# Altium schematic sheet Sheet_1_2023-11-30.schdoc
size 319 x 219 mm
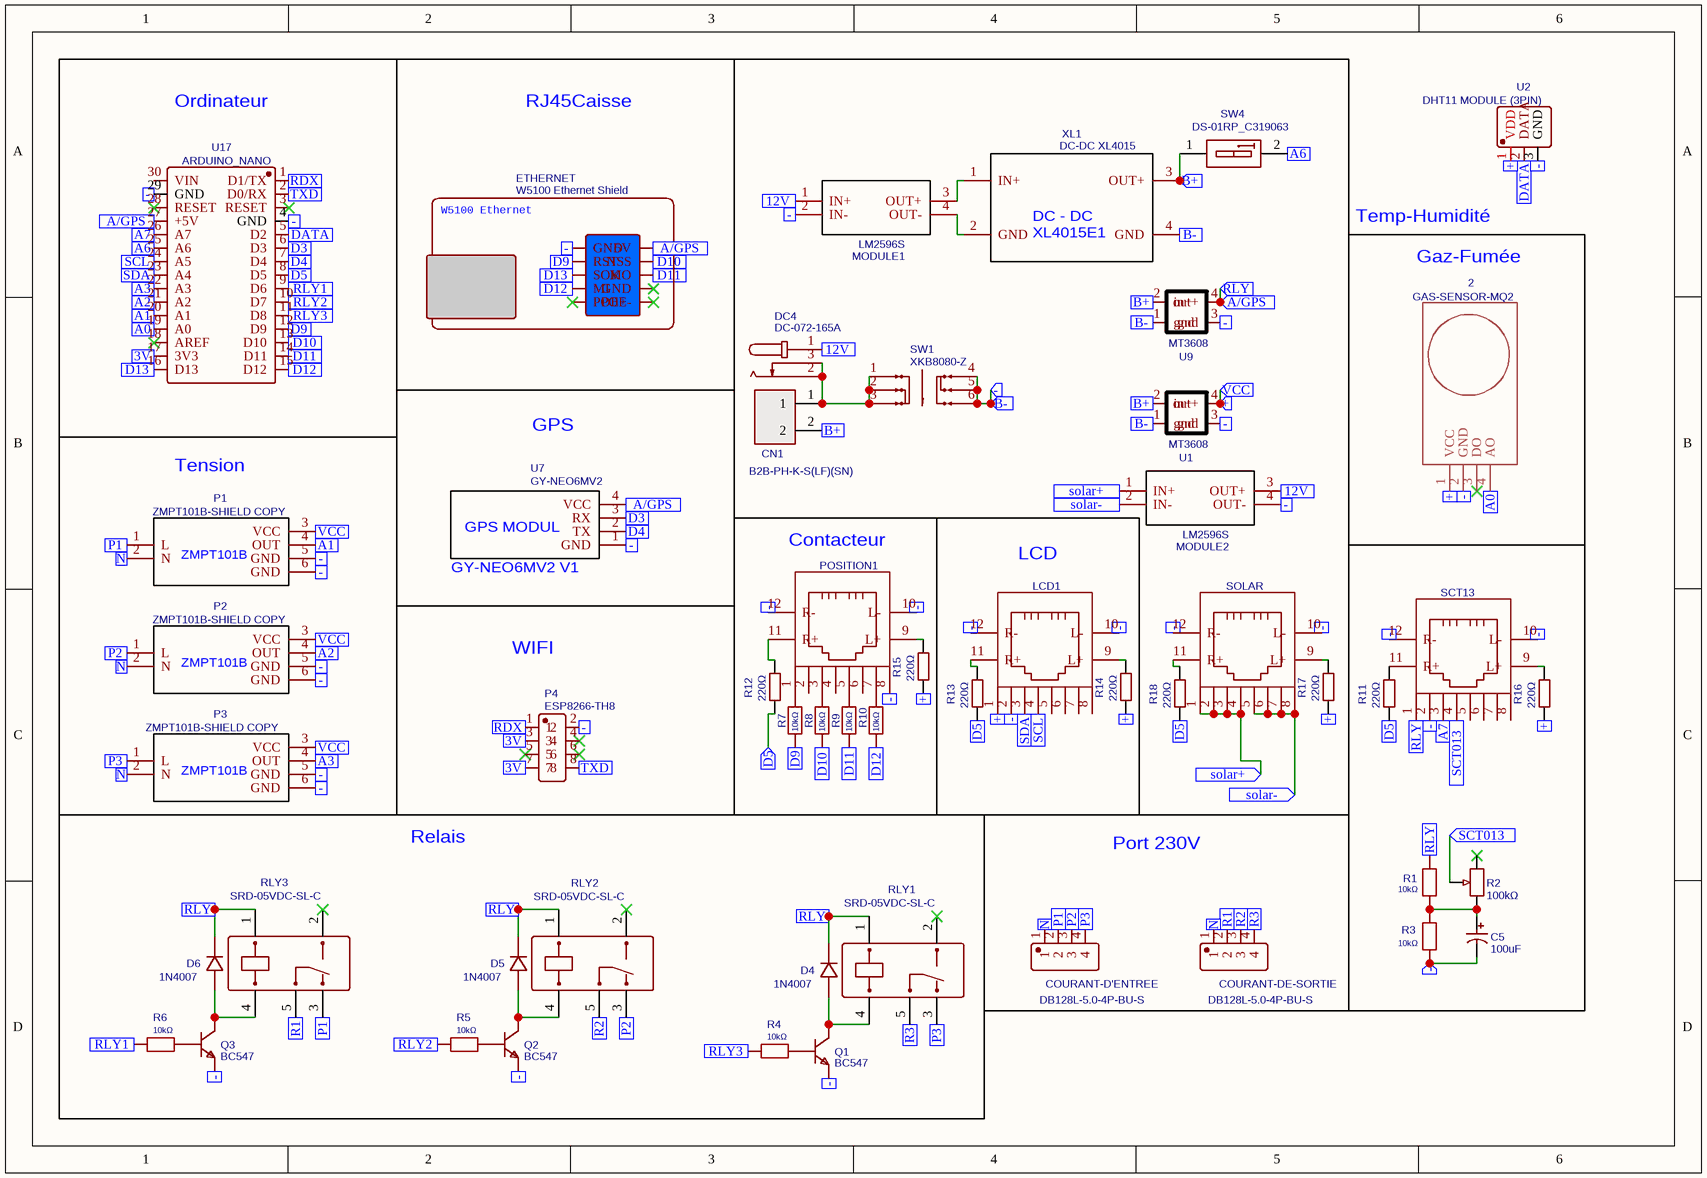
[diagram p0: Sheet_1_2023-11-30.schdoc]

## Parts
2  GAS-SENSOR-MQ2  [GAS-SENSOR-MQ2]
C5  100uF  [CAP-SMD_BD6.3-L6.6-W6.6-FD]
CN1  B2B-PH-K-S(LF)(SN)  [CONN-TH_B2B-PH-K-S]
COURANT-D'ENTREE  DB128L-5.0-4P-BU-S  [CONN-TH_4P-5.00_DB128L-5.0-4P-BU-S]
COURANT-DE-SORTIE  DB128L-5.0-4P-BU-S  [CONN-TH_4P-5.00_DB128L-5.0-4P-BU-S]
D4  1N4007  [DO-41_BD2.4-L4.7-P8.70-D0.9-RD]
D5  1N4007  [DO-41_BD2.4-L4.7-P8.70-D0.9-RD]
D6  1N4007  [DO-41_BD2.4-L4.7-P8.70-D0.9-RD]
DC4  DC-072-165A  [DC-IN-TH_DC-072-165A]
ETHERNET  W5100 Ethernet Shield  [W5100 ETHERNET MINI]
LCD1  MJ5688-Y011-GRNL1  [RJ45-TH_MJ5688-Y011-GRNL1]  (value not drawn)
MODULE1  LM2596S  [LM2596S]
MODULE2  LM2596S  [LM2596S]
P1  ZMPT101B-SHIELD COPY  [ZMPT101B-MODULE]
P2  ZMPT101B-SHIELD COPY  [ZMPT101B-MODULE]
P3  ZMPT101B-SHIELD COPY  [ZMPT101B-MODULE]
P4  ESP8266-TH8  [HDR-TH_8P-P2.54-V-F-R2-C4-S2.54-1]
POSITION1  MJ5688-Y011-GRNL1  [RJ45-TH_MJ5688-Y011-GRNL1]  (value not drawn)
Q1  BC547  [TO92C]
Q2  BC547  [TO92C]
Q3  BC547  [TO92C]
R1  10kΩ  [RES-TH_BD2.3-L6.5-P10.50-D0.5]
R2  100kΩ  [RES-ADJ-TH_3P-L9.5-W4.9-P2.50-L_3296W]
R3  10kΩ  [RES-TH_BD2.3-L6.5-P10.50-D0.5]
R4  10kΩ  [RES-TH_BD2.3-L6.5-P10.50-D0.5]
R5  10kΩ  [RES-TH_BD2.3-L6.5-P10.50-D0.5]
R6  10kΩ  [RES-TH_BD2.3-L6.5-P10.50-D0.5]
R7  10kΩ  [RES-TH_BD2.3-L6.5-P10.50-D0.5]
R8  10kΩ  [RES-TH_BD2.3-L6.5-P10.50-D0.5]
R9  10kΩ  [RES-TH_BD2.3-L6.5-P10.50-D0.5]
R10  10kΩ  [RES-TH_BD2.3-L6.5-P10.50-D0.5]
R11  220Ω  [RES-TH_BD2.2-L6.5-P10.50-D0.6]
R12  220Ω  [RES-TH_BD2.2-L6.5-P10.50-D0.6]
R13  220Ω  [RES-TH_BD2.2-L6.5-P10.50-D0.6]
R14  220Ω  [RES-TH_BD2.2-L6.5-P10.50-D0.6]
R15  220Ω  [RES-TH_BD2.2-L6.5-P10.50-D0.6]
R16  220Ω  [RES-TH_BD2.2-L6.5-P10.50-D0.6]
R17  220Ω  [RES-TH_BD2.2-L6.5-P10.50-D0.6]
R18  220Ω  [RES-TH_BD2.2-L6.5-P10.50-D0.6]
RLY1  SRD-05VDC-SL-C  [RELAY-TH_SRD-XXVDC-XL-C]
RLY2  SRD-05VDC-SL-C  [RELAY-TH_SRD-XXVDC-XL-C]
RLY3  SRD-05VDC-SL-C  [RELAY-TH_SRD-XXVDC-XL-C]
SCT13  MJ5688-Y011-GRNL1  [RJ45-TH_MJ5688-Y011-GRNL1]  (value not drawn)
SOLAR  MJ5688-Y011-GRNL1  [RJ45-TH_MJ5688-Y011-GRNL1]  (value not drawn)
SW1  XKB8080-Z  [SW-TH_6P-L8.0-W8.0-P2.50]
SW4  DS-01RP_C319063  [SW-TH_DS-01RP]
U1  MT3608  [MT3608]
U2  DHT11 MODULE (3PIN)  [DHT11 MODULE 3P]
U7  GY-NEO6MV2  [GY-NEO6MV2]
U9  MT3608  [MT3608]
U17  ARDUINO_NANO  [COMM-TH_ARDUINO_NANO]
XL1  DC-DC XL4015  [DC-DC_XL4015_5A]

## Blocks framed on the sheet
Ordinateur: U17
RJ45Caisse: ETHERNET
Tension: P1-P3
GPS: U7
Contacteur: POSITION1 R7-R10 R12 R15
LCD: LCD1 R13 R14
WIFI: P4
Relais: D4-D6 Q1-Q3 R4-R6 RLY1-RLY3
Port 230V: COURANT-D'ENTREE COURANT-DE-SORTIE

## Ports
3V (in), 12V (in), + (in), - (in), A0 (in), A1 (in), A2 (in), A3 (in), A6 (in), A7 (in), A/GPS (in), B+ (in), B- (in), D3 (in), D4 (in), D5 (in), D9 (in), D10 (in), D11 (in), D12 (in), D13 (in), DATA (in), N (in), P1 (in), P2 (in), P3 (in), R1 (in), R2 (in), R3 (in), RDX (in), RLY1 (in), RLY2 (in), RLY3 (in), RLY (in), SCL (in), SCT013 (in), SDA (in), solar+ (in), solar- (in), TXD (in), VCC (in)

## Nets
3V: P4.3 P4.7 U17.17(3V3) ; port 3V
12V: DC4.1 MODULE1.1(IN+) MODULE2.3(OUT+) ; port 12V
+: 2.1(VCC) LCD1.1 P1.3(VCC) P2.3(VCC) P3.3(VCC) R14.1 R15.1 R16.1 R17.1 U1.4(out+) U2.1(VDD) ; port +, port VCC
-: 2.2(GND) C5.2 ETHERNET.GND_1(GND) LCD1.2 LCD1.10(L-) LCD1.12(R-) MODULE1.2(IN-) MODULE2.4(OUT-) P1.5(GND) P1.6(GND) P2.5(GND) P2.6(GND) P3.5(GND) P3.6(GND) P4.2 POSITION1.8 POSITION1.10(L-) POSITION1.12(R-) Q1.1(E) Q2.1(E) Q3.1(E) R3.2 SCT13.2 SCT13.10(L-) SCT13.12(R-) SOLAR.10(L-) SOLAR.12(R-) SW1.4 SW1.5 SW1.6 U1.1(gnd) U1.3(gnd) U2.3(GND) U7.1(GND) U9.1(gnd) U9.3(gnd) U17.4(GND) U17.29(GND) XL1.4(GND) ; port -, port B-
A0: 2.4(AO) U17.19(A0) ; port A0
A1: P1.4(OUT) U17.20(A1) ; port A1
A2: P2.4(OUT) U17.21(A2) ; port A2
A3: P3.4(OUT) U17.22(A3) ; port A3
A6: SW4.2(A2) U17.25(A6) ; port A6
A7: SCT13.3 U17.26(A7) ; port A7
A/GPS: D4.1(K) D5.1(K) D6.1(K) ETHERNET.5V R1.1 RLY1.1 RLY2.1 RLY3.1 SCT13.1 U7.4(VCC) U9.4(out+) U17.27(+5V) ; port RLY, port A/GPS
B+: CN1.2 SW4.1(A1) U1.2(in+) U9.2(in+) XL1.3(OUT+) ; port B+
D3: U7.3(RX) U17.6(D3) ; port D3
D4: U7.2(TX) U17.7(D4) ; port D4
D5: R11.1 R12.1 R13.1 R18.1 U17.8(D5) ; port D5
D9: ETHERNET.RST R7.2 U17.12(D9) ; port D9
D10: ETHERNET.NSS R8.2 U17.13(D10) ; port D10
D11: ETHERNET.MO R9.2 U17.14(D11) ; port D11
D12: ETHERNET.MI R10.2 U17.15(D12) ; port D12
D13: ETHERNET.SOK U17.16(D13) ; port D13
DATA: U2.2(DATA) U17.5(D2) ; port DATA
N: COURANT-D'ENTREE.1 COURANT-DE-SORTIE.1 P1.2(N) P2.2(N) P3.2(N) ; port N
P1: COURANT-D'ENTREE.2 P1.1(L) RLY3.3 ; port P1
P2: COURANT-D'ENTREE.3 P2.1(L) RLY2.3 ; port P2
P3: COURANT-D'ENTREE.4 P3.1(L) RLY1.3 ; port P3
R1: COURANT-DE-SORTIE.2 RLY3.5 ; port R1
R2: COURANT-DE-SORTIE.3 RLY2.5 ; port R2
R3: COURANT-DE-SORTIE.4 RLY1.5 ; port R3
RDX: P4.1 U17.1(D1/TX) ; port RDX
RLY1: R6.2 U17.9(D6) ; port RLY1
RLY2: R5.2 U17.10(D7) ; port RLY2
RLY3: R4.2 U17.11(D8) ; port RLY3
SCL: LCD1.4 U17.24(A5) ; port SCL
SCT013: R2.2 SCT13.4 ; port SCT013
SDA: LCD1.3 U17.23(A4) ; port SDA
solar+: MODULE2.1(IN+) SOLAR.1 SOLAR.2 SOLAR.3 SOLAR.4 ; port solar+
solar-: MODULE2.2(IN-) SOLAR.5 SOLAR.6 SOLAR.7 SOLAR.8 ; port solar-
TXD: P4.8 U17.2(D0/RX) ; port TXD
NetC5_1: C5.1 R1.2 R2.1 R3.1
NetCN1_1: CN1.1 DC4.2 DC4.3 SW1.1 SW1.2 SW1.3
NetD4_2: D4.2(A) Q1.3(C) RLY1.4
NetD5_2: D5.2(A) Q2.3(C) RLY2.4
NetD6_2: D6.2(A) Q3.3(C) RLY3.4
NetLCD1_9: LCD1.9(L+) R14.2
NetLCD1_11: LCD1.11(R+) R13.2
NetMODULE1_3: MODULE1.3(OUT+) XL1.1(IN+)
NetMODULE1_4: MODULE1.4(OUT-) XL1.2(GND)
NetPOSITION1_1: POSITION1.1 R7.1
NetPOSITION1_3: POSITION1.3 R8.1
NetPOSITION1_5: POSITION1.5 R9.1
NetPOSITION1_7: POSITION1.7 R10.1
NetPOSITION1_9: POSITION1.9(L+) R15.2
NetPOSITION1_11: POSITION1.11(R+) R12.2
NetQ1_2: Q1.2(B) R4.1
NetQ2_2: Q2.2(B) R5.1
NetQ3_2: Q3.2(B) R6.1
NetR11_2: R11.2 SCT13.11(R+)
NetR16_2: R16.2 SCT13.9(L+)
NetR17_2: R17.2 SOLAR.9(L+)
NetR18_2: R18.2 SOLAR.11(R+)

Not connected (* = marked no-connect by the designer): 2 3(DO)*; ETHERNET GND_2(GND)* POE+* POE-*; LCD1 5 6 7 8; P4 4* 5* 6*; POSITION1 2 4 6; R2 3*; RLY1 2*; RLY2 2*; RLY3 2*; SCT13 5 6 7 8; U17 3(RESET)* 18(AREF)* 28(RESET)* 30(VIN)

## Notes on the sheet
- Temp-Humidité
- Gaz-Fumée
- (in symbol DC-DC XL4015) DC - DC / XL4015E1
- (in symbol GY-NEO6MV2) GPS MODUL; GY-NEO6MV2 V1
- (in symbol W5100 Ethernet Shield) W5100 Ethernet
- (in symbol ZMPT101B-SHIELD COPY) ZMPT101B

## Library data of the parts
2 = GAS-SENSOR-MQ2: Contributor: osorobevon123; spicePre: ?; spiceSymbolName: GAS-SENSOR-MQ2
C5 = 100uF: Manufacturer: Nichicon(尼吉康); Manufacturer Part: UWX1C101MCL1GB; nameAlias: Capacitance; Supplier: LCSC; Supplier Part: C111600; JLCPCB Part Class: Extended Part; spicePre: C; spiceSymbolName: UWX1C101MCL1GB
CN1 = B2B-PH-K-S(LF)(SN): Manufacturer: JST; Contributor: LCSC; Supplier: LCSC; Manufacturer Part: B2B-PH-K-S(LF)(SN); Supplier Part: C131337; JLCPCB Part Class: Extended Part; link: https://lcsc.com/eda_search?q=C131337&%26type=1&ref=editor; spicePre: C; spiceSymbolName: B2B-PH-K-S(LF)(SN)
COURANT-D'ENTREE COURANT-DE-SORTIE = DB128L-5.0-4P-BU-S: Manufacturer: DIBO(地博电气); Contributor: LCSC; Supplier: LCSC; Supplier Part: C430599; Manufacturer Part: DB128L-5.0-4P-BU-S; JLCPCB Part Class: Extended Part; spicePre: U; spiceSymbolName: DB128L-5.0-4P-BU-S
D4-D6 = 1N4007: Manufacturer: VISHAY(威世); Manufacturer Part: 1N4007E-E3/54; Contributor: LCSC; Supplier: LCSC; Supplier Part: C144970; JLCPCB Part Class: Extended Part; spicePre: D; spiceSymbolName: 1N4007E-E3/54
DC4 = DC-072-165A: Manufacturer: HRO; Supplier: LCSC; Manufacturer Part: DC-072-165A; Supplier Part: C129003; spicePre: D; spiceSymbolName: DC-072-165A
ETHERNET = W5100 Ethernet Shield: Contributor: DavidQ; spicePre: X; spiceSymbolName: W5100 Ethernet Shield
LCD1 POSITION1 SCT13 SOLAR = MJ5688-Y011-GRNL1: Manufacturer: Heling(合陵); Contributor: LCSC; Supplier: LCSC; Supplier Part: C501470; Manufacturer Part: MJ5688-Y011-GRNL1; JLCPCB Part Class: Extended Part; spicePre: R; spiceSymbolName: MJ5688-Y011-GRNL1
MODULE1 MODULE2 = LM2596S: Manufacturer Part: LM2596; Contributor: Jonatan Arango Gomez; link: http://www.alldatasheet.com/datasheet-pdf/pdf/8744/NSC/LM2596.html; spicePre: M; spiceSymbolName: LM2596S
P1-P3 = ZMPT101B-SHIELD COPY: Manufacturer: sterling; Contributor: Bosco_Sterling; Supplier: LCSC; link: https://lcsc.com/product-detail/Current-Transformers_Qingxian-Zeming-Langxi-Elec-ZMPT101B_C111858.html; spicePre: U; spiceSymbolName: ZMPT101B-SHIELD COPY
P4 = ESP8266-TH8: Manufacturer: null; Contributor: LCSC; Supplier: LCSC; Supplier Part: C9900003199; Manufacturer Part: ESP8266-TH8; JLCPCB Part Class: Extended Part; spicePre: P; spiceSymbolName: ESP8266-TH8
Q1-Q3 = BC547: nameAlias: Model; sourceId: vnaKWUSsp; sim: true; Contributor: elifnur.ozcan; spicePre: Q; spiceSymbolName: BC547COPY
R1 R3-R10 = 10kΩ: Manufacturer: Huaxing Mechanical-Elec.; Manufacturer Part: MF1/4W-100KΩ±1%T52; nameAlias: Resistance (Ohms); Contributor: LCSC; Resistance: 100kΩ; Supplier: LCSC; Supplier Part: C714036; JLCPCB Part Class: Extended Part; spicePre: R; spiceSymbolName: MF1/4W-100KΩ±1%T52
R2 = 100kΩ: Manufacturer: BOCHEN(博晨); Manufacturer Part: 3296W-1-104; Resistance(Ohms): 100K; nameAlias: Resistance; Contributor: LCSC; Supplier: LCSC; Supplier Part: C118963; Resistance (Ohms): 100K; JLCPCB Part Class: Extended Part; spicePre: R; spiceSymbolName: 3296W-1-104
R11-R18 = 220Ω: Manufacturer: UNI-ROYAL(厚声); Manufacturer Part: MFR0W4F2200A50; nameAlias: Value; Supplier: LCSC; Supplier Part: C57439; JLCPCB Part Class: Extended Part; link: https://lcsc.com/eda_search?q=C57439&%26type=1&ref=editor; spicePre: R; spiceSymbolName: MFR0W4F2200A50
RLY1-RLY3 = SRD-05VDC-SL-C: Manufacturer: 松乐; Supplier: LCSC; Manufacturer Part: SRD-05VDC-SL-C; Supplier Part: C35449; JLCPCB Part Class: Extended Part; spicePre: R; spiceSymbolName: SRD-05VDC-SL-C
SW1 = XKB8080-Z: Manufacturer: XKB Enterprise; Contributor: LCSC; Supplier: LCSC; Supplier Part: C318860; Manufacturer Part: XKB8080-Z; JLCPCB Part Class: Extended Part; link: https://lcsc.com/eda_search?q=C318860&%26type=1&ref=editor; spicePre: S; spiceSymbolName: XKB8080-Z
SW4 = DS-01RP_C319063: Manufacturer: XKB Enterprise; Contributor: LCSC; Supplier: LCSC; Supplier Part: C319063; Manufacturer Part: DS-01RP; JLCPCB Part Class: Extended Part; spicePre: S; spiceSymbolName: DS-01RP_C319063
U1 U9 = MT3608: Manufacturer Part: dc/dc; Contributor: Ripleigh; spicePre: U; spiceSymbolName: dc dc
U2 = DHT11 MODULE (3PIN): Manufacturer: Aosong (Guangzhou) Elec; Contributor: danishjr.hd; Supplier: LCSC; Supplier Part: C117051; Manufacturer Part: DHT11; spicePre: U; spiceSymbolName: DHT11 MODULE (3PIN)
U7 = GY-NEO6MV2: Contributor: Alex Fedosov; spicePre: U; spiceSymbolName: GY-NEO6MV2
U17 = ARDUINO_NANO: Manufacturer: null; Contributor: lcsc; Supplier: LCSC; Supplier Part: C9900017879; Manufacturer Part: ARDUINO_NANO; JLCPCB Part Class: Extended Part; spicePre: U; spiceSymbolName: ARDUINO_NANO
XL1 = DC-DC XL4015: Contributor: Николай Суриков; spicePre: X; spiceSymbolName: DC-DC XL4015